# Altium schematic sheet TopSheet.SchDoc
size A4; Author: Timo Wilfling; Address1: TH Nürnberg; Address2: Georg Simon Ohm; Address3: Kesslerplatz 10; Address4: 90489 Nürnberg; SheetNumber: 1; SheetTotal: 8
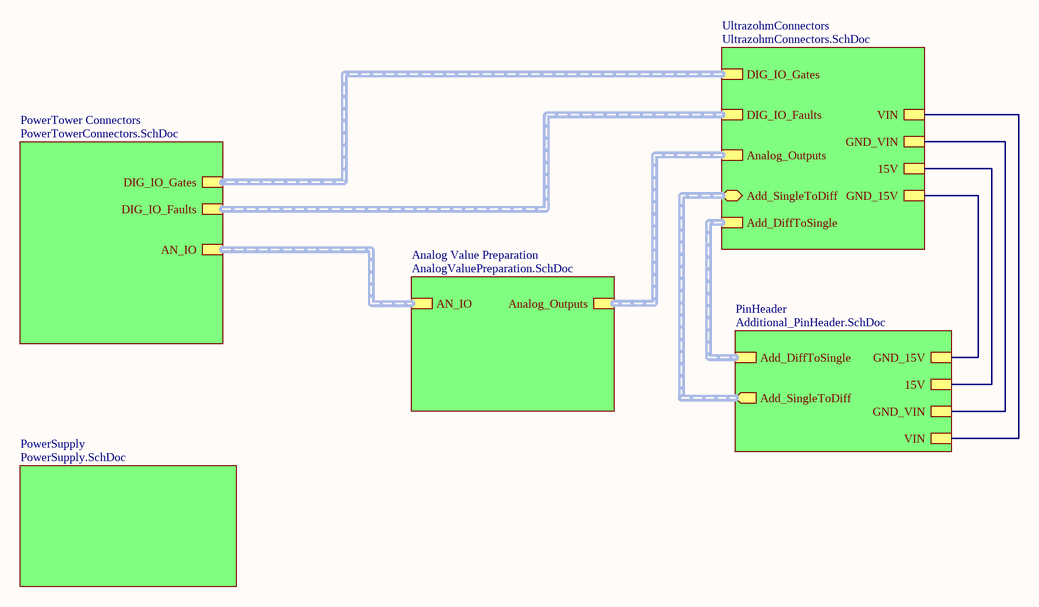
[diagram p0: TopSheet.SchDoc]

## Sub-sheets
Analog Value Preparation = AnalogValuePreparation.SchDoc: AN_IO (harness Analog_Connector), Analog_Outputs (harness Analog Outputs)
PinHeader = Additional_PinHeader.SchDoc: Add_SingleToDiff (out, harness Add_SingleToDiff), Add_DiffToSingle (harness Add_DiffToSingle), GND_15V, 15V, GND_VIN, VIN
PowerSupply = PowerSupply.SchDoc: no entries
PowerTower Connectors = PowerTowerConnectors.SchDoc: DIG_IO_Gates (harness DigCon_DIG_IO_Gates), AN_IO (harness Analog_Connector), DIG_IO_Faults (harness DigCon_DIG_IO_Faults)
UltrazohmConnectors = UltrazohmConnectors.SchDoc: DIG_IO_Gates (harness DigCon_DIG_IO_Gates), Analog_Outputs (harness Analog Outputs), DIG_IO_Faults (harness DigCon_DIG_IO_Faults), Add_SingleToDiff (bidir, harness Add_SingleToDiff), VIN, GND_VIN, 15V, GND_15V, Add_DiffToSingle (harness Add_DiffToSingle)

## Nets
(unnamed): sheet UltrazohmConnectors/VIN, sheet PinHeader/VIN
(unnamed): sheet UltrazohmConnectors/GND_VIN, sheet PinHeader/GND_VIN
(unnamed): sheet UltrazohmConnectors/15V, sheet PinHeader/15V
(unnamed): sheet UltrazohmConnectors/GND_15V, sheet PinHeader/GND_15V

## Buses and harness runs
harness sheet Analog Value Preparation/AN_IO = sheet PowerTower Connectors/AN_IO
harness sheet Analog Value Preparation/Analog_Outputs = sheet UltrazohmConnectors/Analog_Outputs
harness sheet PinHeader/Add_DiffToSingle = sheet UltrazohmConnectors/Add_DiffToSingle
harness sheet PinHeader/Add_SingleToDiff = sheet UltrazohmConnectors/Add_SingleToDiff
harness sheet PowerTower Connectors/DIG_IO_Faults = sheet UltrazohmConnectors/DIG_IO_Faults
harness sheet PowerTower Connectors/DIG_IO_Gates = sheet UltrazohmConnectors/DIG_IO_Gates

## Notes on the sheet
- Title
- Size:
- Date:
- A4
- Revision:
- Time:
- Sheet
- of
- Author:
- Project: